# EAGLE design laser ontvanger (EAGLE 9.3.2)
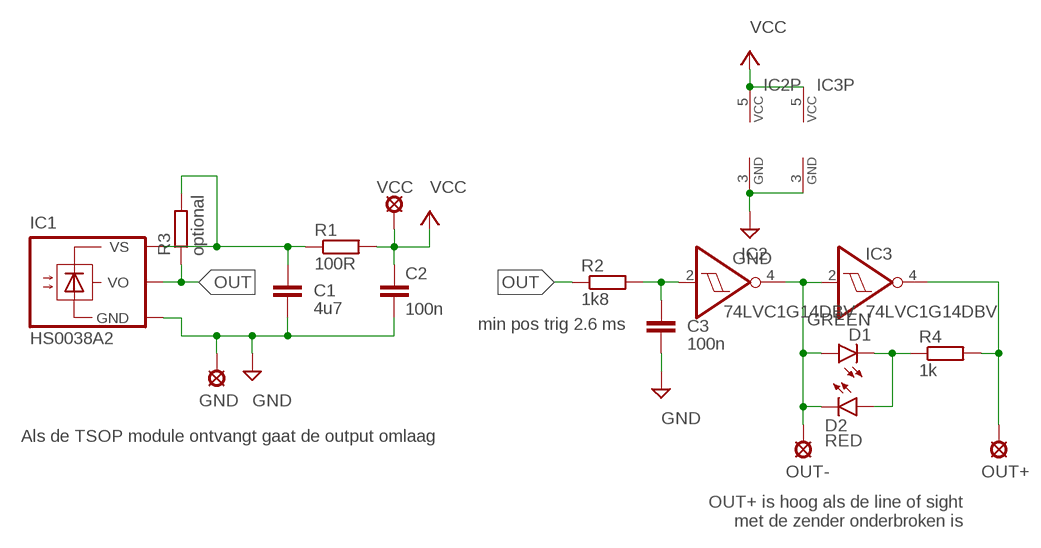
[diagram p0: schematic, sheet 1]

## Parts
C1  4u7  C-EUC0805  [C0805]
C2  100n  C-EUC0805  [C0805]
C3  100n  C-EUC0805  [C0805]
D1  GREEN  LEDCHIP-LED0805  [CHIP-LED0805]
D2  RED  LEDCHIP-LED0805  [CHIP-LED0805]
GND  LSP10  [LSP10]
IC1  HS0038A2  [TSOP17_TB1]
IC2  74LVC1G14DBV  [SOT23-5]
IC3  74LVC1G14DBV  [SOT23-5]
OUT+  LSP10  [LSP10]
OUT-  LSP10  [LSP10]
R1  100R  R-EU_R0805  [R0805]
R2  1k8  R-EU_R0805  [R0805]
R3  optional  R-EU_R0805  [R0805]
R4  1k  R-EU_R0805  [R0805]
VCC  LSP10  [LSP10]

## Nets
GND: C1.2 C2.2 C3.2 GND.MP IC1.GND IC2.3(GND) IC3.3(GND)
N$1: C3.1 IC2.2(I) R2.2
N$2: D1.C D2.A R4.1
N$3: D1.A D2.C IC2.4(O) IC3.2(I) OUT-.MP
N$4: IC3.4(O) OUT+.MP R4.2
N$5: C1.1 IC1.VS R1.1 R3.2
OUT: IC1.VO R2.1 R3.1
VCC: C2.1 IC2.5(VCC) IC3.5(VCC) R1.2 VCC.MP

## Notes on the sheet
- min pos trig 2.6 ms
- Als de TSOP module ontvangt gaat de output omlaag
- OUT+ is hoog als de line of sight
  met de zender onderbroken is

## Library data of the parts
C1-C3 = rcl:C-EU: CAPACITOR, European symbol; SPICEPREFIX: C
D1 D2 = led:LED: LED OSRAM: - CHIPLED LG R971, LG N971, LY N971, LG Q971, LY Q971, LO R971, LY R971 LH N974, LH R974 LS Q976, LO Q976, LY Q976 LO Q996 - Hyper CHIPLED LW Q18S LB Q993, LB Q99A, LB R99A - SideLED LS A670, LO A670, LY A670, LG A670, LP A670 LB A673, LV A673, LT A673, LW A673 LH A674 LY A675 LS A676, LA A676, LO A676, LY A676, LW A676 LS A679, LY A679, LG A679 - Hyper Micro SIDELED® LS Y876, LA Y876, LO Y876, LY Y876 LT Y87S - SmartLED LW L88C, LW L88S LB L89C, LB L89S, LG L890 LS L89K, LO L89K, LY L89K LS L896, LA L896, LO L896, LY L896 - TOPLED LS T670, LO T670, LY T670, LG T670, LP T670 LSG T670, LSP T670, LSY T670, LOP T670, LYG T670 LG T671, LOG T671, LSG T671 LB T673, LV T673, LT T673, LW T673 LH T674 LS T676, LA T676, LO T676, LY T676, LB T676, LH T676, LSB T676, LW T676 LB T67C, LV T67C, LT T67C, LS T67K, LO T67K, LY T67K, LW E67C LS E67B, LA E67B, LO E67B, LY E67B, LB E67C, LV E67C, LT E67C LW T67C LS T679, LY T679, LG T679 LS T770, LO T770, LY T770, LG T770, LP T770 LB T773, LV T773, LT T773, LW T773 LH T774 LS E675, LA E675, LY E675, LS T675 LS T776, LA T776, LO T776, LY T776, LB T776 LHGB T686 LT T68C, LB T68C - Hyper Mini TOPLED® LB M676 - Mini TOPLED Santana® LG M470 LS M47K, LO M47K, LY M47K Source: http://www.osram.convergy.de LUXEON: - LUMILED® LXK2-PW12-R00, LXK2-PW12-S00, LXK2-PW14-U00, LXK2-PW14-V00 LXK2-PM12-R00, LXK2-PM12-S00, LXK2-PM14-U00 LXK2-PE12-Q00, LXK2-PE12-R00, LXK2-PE12-S00, LXK2-PE14-T00, LXK2-PE14-U00 LXK2-PB12-K00, LXK2-PB12-L00, LXK2-PB12-M00, LXK2-PB14-N00, LXK2-PB14-P00, LXK2-PB14-Q00 LXK2-PR12-L00, LXK2-PR12-M00, LXK2-PR14-Q00, LXK2-PR14-R00 LXK2-PD12-Q00, LXK2-PD12-R00, LXK2-PD12-S00 LXK2-PH12-R00, LXK2-PH12-S00 LXK2-PL12-P00, LXK2-PL12-Q00, LXK2-PL12-R00 Source: www.luxeon.com KINGBRIGHT: KA-3528ASYC Source: www.kingbright.com
GND OUT+ OUT- VCC = solpad:LSP10: SOLDER PAD drill 1.0 mm, distributor Buerklin, 12H555
IC1 = HS0038A2:HS0038A2
IC2 IC3 = 74xx-little-de:74*1G14: Single Schmitt-Trigger Inverter Gate
R1-R4 = rcl:R-EU_: RESISTOR, European symbol; SPICEPREFIX: R

## Board
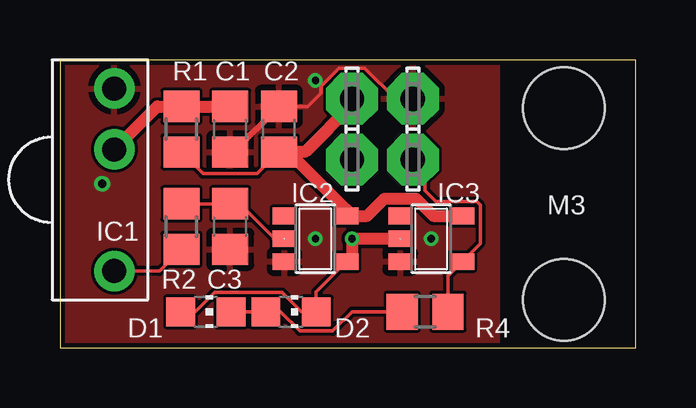
[diagram p1: board, top side]
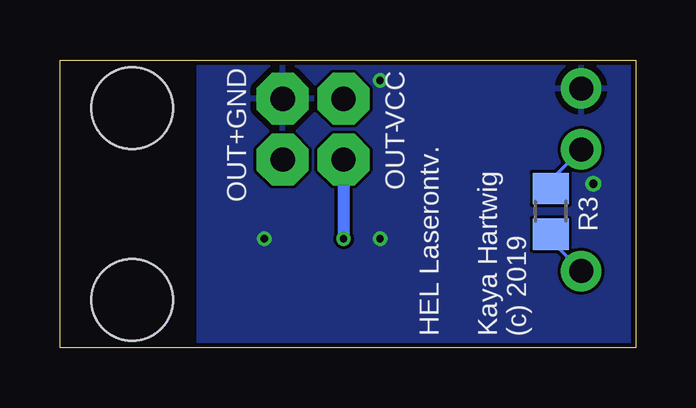
[diagram p2: board, bottom side, seen from below]

Size 24 x 12 mm. Coordinates in mm from the lower left corner, seen from the top.
Outline: 0,0 24,0 24,12 0,12 0,0
Copper layers (1*16): Top 0.035mm / dielectric 1.5mm / Bottom 0.035mm
Design rules "default": minimum track width 5mil, minimum drill 0.3mm, track to track 5mil, track to pad 5mil, pad to pad 5mil, via to via 5mil, smd to smd 5mil, copper to edge 0.2mm, drill to drill 6mil, minimum pad ring 10mil, minimum via ring 0.15mm, stop-mask expansion 4mil, vias tented up to drill 0mil, thermal gap 10mil
Holes 3.4 mm at 21,10 21,2

### Footprints (pad centres in the part's own frame; a part is rotated, then mirrored left to right if it is on the bottom)
C0805 = smd 1.3 x 1.5: 1 -0.95,0; 2 0.95,0
CHIP-LED0805 = smd 1.2 x 1.2: A 0,-1.05; C 0,1.05
LSP10 = drill 1.016 pad 2.159 octagon: MP 0,0
TSOP17_TB1 = drill 1 pad 1.676: GND 0,-3.81; VO 0,3.81; VS 0,-1.27
SOT23-5 = smd 0.69 x 0.99: 1 -0.95,-1.29; 2 0,-1.29; 3 0.95,-1.29; 4 0.95,1.3; 5 -0.95,1.3
R0805 = smd 1.3 x 1.5: 1 -0.95,0; 2 0.95,0

### Placement (x,y rotation side)
C1  7.1,9.11 270 top
C2  9.13,9.11 90 top
C3  7.1,5.05 270 top
D1  6.08,1.49 270 top
D2  9.64,1.49 270 top
GND  14.72,10.38 270 top
IC1  2.27,7 180 top
IC2  10.65,4.54 270 top
IC3  15.48,4.54 270 top
OUT+  14.72,7.84 270 top
OUT-  12.18,7.84 270 top
R1  5.06,9.11 270 top
R2  5.06,5.05 90 top
R3  3.54,5.68 90 bottom
R4  15.22,1.49 0 top
VCC  12.18,10.38 270 top

### Tracks (layer width: path | path; a pad name or v marks a point on that pad's centre or on a via)
GND  (via drill 0.3, 0.35)
  Top 0.152: GND.MP 13.99,10.38 12.71,11.66 11.64,11.66 10.89,10.91 10.89,10.62 10.33,10.06 C2.2
  Top 0.254: C1.2 7.23,8.16 C2.2
  other vias: 10.65,4.54 15.48,4.54 10.65,11.14 1.76,6.83
  pour Top: 18.27,-1.81 18.27,15.46 -4.33,15.46 -4.33,-1.81
  pour Bottom: -1.03,12.92 -1.03,-1.02 18.24,-1.02 18.24,12.92
N$1
  Top 0.152: 8.97,4.54 7.51,6 | C3.1 R2.2
  Top 0.254: IC2.2 8.97,4.54 | 7.51,6 C3.1
N$2
  Top 0.152: D1.C D2.A 9.2,1.49 10,0.69 11.37,0.69 12.17,1.49 R4.1
N$3  (via drill 0.3)
  Top 0.152: D1.A 5.64,1.49 6.45,2.29 9.27,2.29 10.07,1.49 D2.C 10.69,2.32 IC2.4
  Top 0.508: IC2.4 12.18,3.81 v12.18,4.54 IC3.2
  Bottom 0.508: OUT-.MP v12.18,4.54
N$4
  Top 0.152: OUT+.MP 15.22,7.33 15.22,6.55 15.69,6.09 17.38,6.09 17.53,5.94 17.53,4.34 IC3.4 16.17,2.99 R4.2
N$5
  Top 0.508: C1.1 R1.1 4.06,10.06 IC1.VS
  Bottom 0.152: R3.2 3.54,7 IC1.VS
OUT
  Top 0.152: R2.1 4.16,3.19 IC1.VO
  Bottom 0.152: R3.1 3.54,4.46 IC1.VO
VCC
  Top 0.152: R1.2 5.97,7.26 8.22,7.26 C2.1
  Top 0.508: VCC.MP 12.18,10.13 10.21,8.16 C2.1 9.53,8.16 11.95,5.74 IC2.5 12.81,5.49 13.54,6.22 14.84,6.22 15.57,5.49 IC3.5

### Text on the board
tPlace: M3
bNames: HEL Laserontv. / / Kaya Hartwig / (c) 2019